# Altium schematic sheet Audio.SchDoc: Audio
size A4; DrawnBy: TueTD; Stage: DRAFT
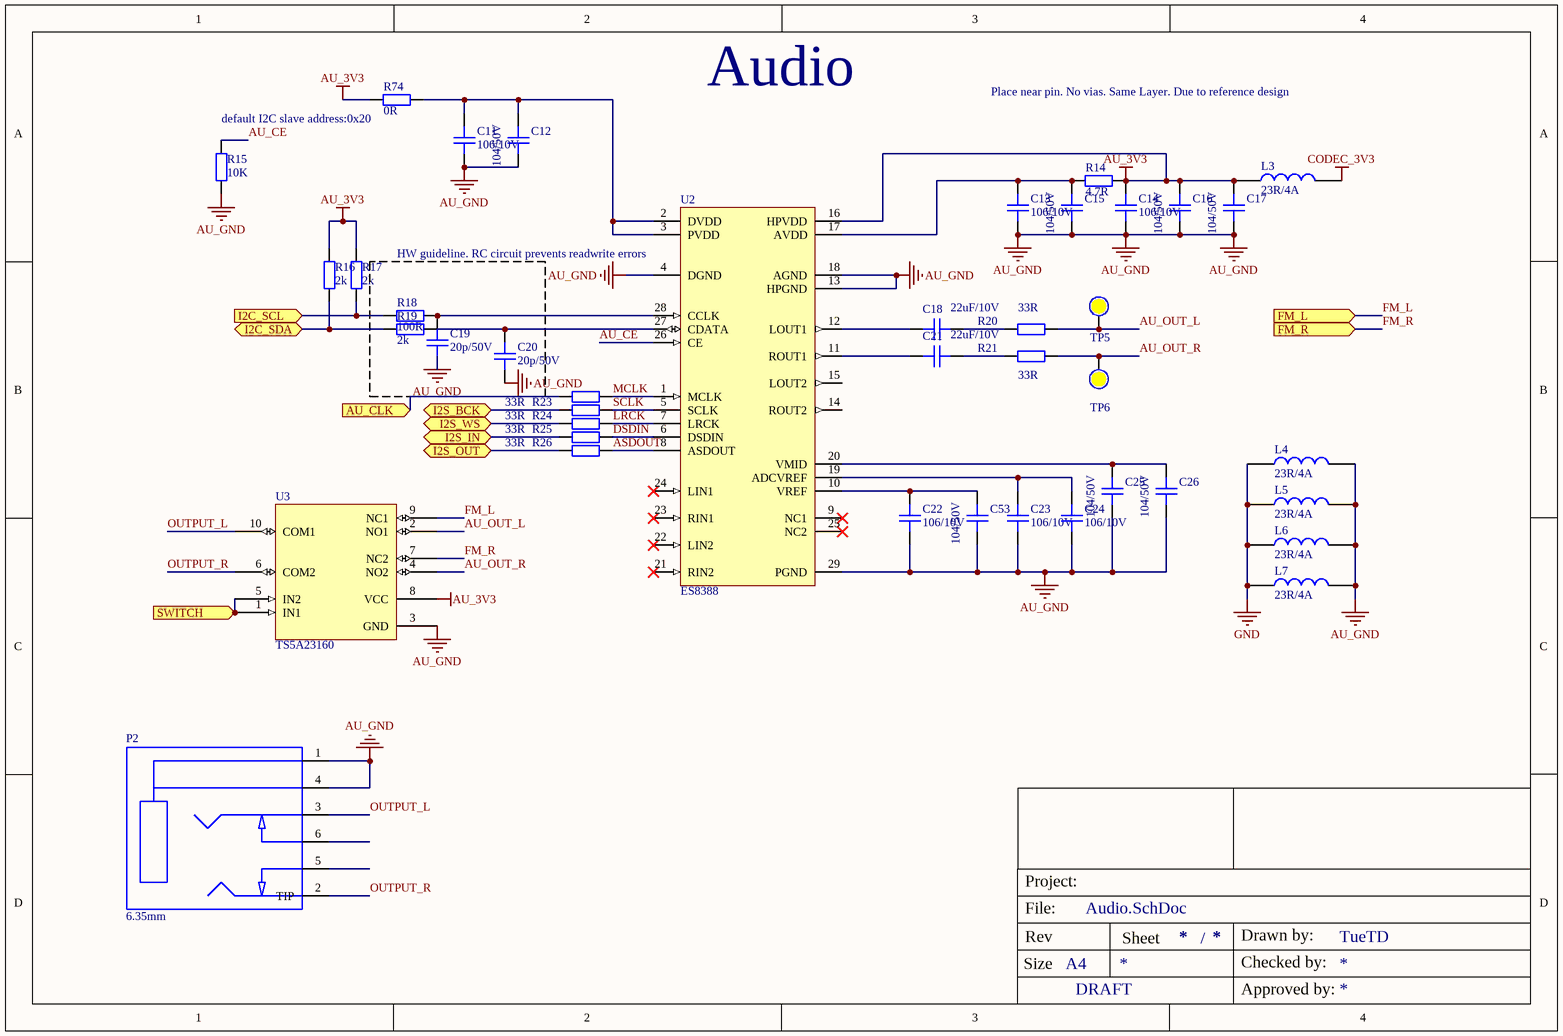
[diagram p0: Audio.SchDoc]

## Parts
C11  106/10V  [CAPC-0603 (1608)]
C12  104/50V  [CAPC-0603 (1608)]
C13  106/10V  [CAPC-0603 (1608)]
C14  106/10V  [CAPC-0603 (1608)]
C15  104/50V  [CAPC-0603 (1608)]
C16  104/50V  [CAPC-0603 (1608)]
C17  104/50V  [CAPC-0603 (1608)]
C18  22uF/10V  [CAPC-0603 (1608)]
C19  20p/50V  [CAPC-0603 (1608)]
C20  20p/50V  [CAPC-0603 (1608)]
C21  22uF/10V  [CAPC-0603 (1608)]
C22  106/10V  [CAPC-0603 (1608)]
C23  106/10V  [CAPC-0603 (1608)]
C24  106/10V  [CAPC-0603 (1608)]
C25  104/50V  [CAPC-0603 (1608)]
C26  104/50V  [CAPC-0603 (1608)]
C53  104/50V  [CAPC-0603 (1608)]
L3  23R/4A  [IND-0603 (1608)]
L4  23R/4A  [IND-0603 (1608)]
L5  23R/4A  [IND-0603 (1608)]
L6  23R/4A  [IND-0603 (1608)]
L7  23R/4A  [IND-0603 (1608)]
P2  6.35mm  [CK-6.35-636A]
R14  4.7R  [RESC-0603 (1608)]
R15  10K  [RESC-0603 (1608)]
R16  2k  [RESC-0603 (1608)]
R17  2k  [RESC-0603 (1608)]
R18  100R  [RESC-0603 (1608)]
R19  2k  [RESC-0603 (1608)]
R20  33R  [RESC-0603 (1608)]
R21  33R  [RESC-0603 (1608)]
R22  33R  [RESC-0603 (1608)]  (value not drawn)
R23  33R  [RESC-0603 (1608)]
R24  33R  [RESC-0603 (1608)]
R25  33R  [RESC-0603 (1608)]
R26  33R  [RESC-0603 (1608)]
R74  0R  [RESC-0603 (1608)]
TP5  (no value)  [Test Point 1.5 MM]  (no BOM)
TP6  (no value)  [Test Point 1.5 MM]  (no BOM)
U2  ES8388  [QFN28 - ES8388]
U3  TS5A23160  [TSSOP50P490X110-10N]

## Blocks framed on the sheet
HW guideline. RC circuit prevents readwrite errors: C19 C20 R18 R19

## Ports
AU_CLK (in), FM_L (in), FM_R (in), I2C_SCL (in), I2C_SDA (bidir), I2S_BCK (bidir), I2S_IN (bidir), I2S_OUT (bidir), I2S_WS (bidir), SWITCH (in)

## Nets
AU_3V3: C14.2 C16.2 C17.2 L3.1 R14.2 R16.2 R17.2 R74.1 U2.16(HPVDD) U3.8(VCC)
AU_GND: C11.1 C12.1 C13.1 C14.1 C15.1 C16.1 C17.1 C19.1 C20.1 C22.1 C23.1 C24.1 C25.1 C26.1 C53.1 L4.2 L5.2 L6.2 L7.2 P2.1(SLEEVE) P2.4(SLEEVE) R15.1 U2.4(DGND) U2.13(HPGND) U2.18(AGND) U2.29(PGND) U3.3(GND)
CODEC_3V3: L3.2
GND: L4.1 L5.1 L6.1 L7.1
ASDOUT: R26.2 U2.8(ASDOUT)
AU_CE: R15.2 U2.26(CE)
AU_CLK: R22.1 ; port AU_CLK
AU_OUT_L: R20.2 TP5.0 U3.2(NO1)
AU_OUT_R: R21.2 TP6.0 U3.4(NO2)
DSDIN: R25.2 U2.6(DSDIN)
FM_L: U3.9(NC1) ; port FM_L
FM_R: U3.7(NC2) ; port FM_R
I2C_SCL: R17.1 R18.1 ; port I2C_SCL
I2C_SDA: R16.1 R19.1 ; port I2C_SDA
I2S_BCK: R23.1 ; port I2S_BCK
I2S_IN: R25.1 ; port I2S_IN
I2S_OUT: R26.1 ; port I2S_OUT
I2S_WS: R24.1 ; port I2S_WS
LRCK: R24.2 U2.7(LRCK)
MCLK: R22.2 U2.1(MCLK)
OUTPUT_L: P2.3(RING) U3.10(COM1)
OUTPUT_R: P2.2(TIP) U3.6(COM2)
SCLK: R23.2 U2.5(SCLK)
SWITCH: U3.1(IN1) U3.5(IN2) ; port SWITCH
NetC11_2: C11.2 C12.2 R74.2 U2.2(DVDD) U2.3(PVDD)
NetC13_2: C13.2 C15.2 R14.1 U2.17(AVDD)
NetC18_1: C18.1 R20.1
NetC18_2: C18.2 U2.12(LOUT1)
NetC19_2: C19.2 R18.2 U2.28(CCLK)
NetC20_2: C20.2 R19.2 U2.27(CDATA)
NetC21_1: C21.1 R21.1
NetC21_2: C21.2 U2.11(ROUT1)
NetC22_2: C22.2 C53.2 U2.10(VREF)
NetC23_2: C23.2 C24.2 U2.19(ADCVREF)
NetC25_2: C25.2 C26.2 U2.20(VMID)

Not connected (* = marked no-connect by the designer): P2 5(TIP_SWITCH) 6(RING_SWITCH); U2 9(NC1)* 14(ROUT2) 15(LOUT2) 21(RIN2)* 22(LIN2)* 23(RIN1)* 24(LIN1)* 25(NC2)*

## Notes on the sheet
- Place near pin. No vias. Same Layer. Due to reference design
- (near R74) default I2C slave address:0x20
- Project:
- File:
- Size
- Rev
- A4
- Sheet
- /
- Drawn by:
- Checked by:
- Approved by:

## Library data of the parts
C11 C13 C14 C22-C24 = CL10A106KP8NNNC: CAP CER 10uF 10% 10V X5R 0603; CompanyID: VT-00984; Solder: SMT; MPN: CL10A106KP8NNNC; Value: 106/10V; Category: CAPACITOR
C12 C15-C17 C25 C26 C53 = C0603C104K5RACTU: CAP CER 0.1uF 50V 10% X7R 0603; CompanyID: VT-00982; Solder: SMT; MPN: C0603C104K5RACTU; Value: 104/50V; Category: CAPACITOR
C18 C21 = CL10A226MPCNUBE: CAP CER 22UF 10V X5R 0603; CompanyID: VT-00192; Solder: SMT; MPN: CL10A226MPCNUBE; Value: 22uF/10V; Category: CAPACITOR
C19 C20 = CL10C200JB8NNNC: CAP CER 20pF 5% 50V C0G/NP0 0603; CompanyID: VT-00515; Solder: SMT; Value: 20p/50V; MPN: CL10C200JB8NNNC; Category: CAPACITOR
L3-L7 = FBMJ1608HM230NT: IND-FERRITE BEAD 23 OHM  4A 0603 1LN; CompanyID: VT-01060; Solder: SMT; MPN: FBMJ1608HM230NT; Value: 23R/4A; Category: FERRITE BEAD
P2 = CK-6.35-636A: CONN JACK STEREO 1/4" R/A; MFR: DONGGUAN YIJIAN ELECTRONICS CO., LTD.; Solder: WAVE; MFR_URL: https://wzyjdzkj.taobao.com; MPN: CK-6.35-636A; Value: CK-6.35-636A; ClassName: MECHANICAL
R14 = RC0603FR-074R7L: RES SMD 4.7 OHM 1% 1/10W 0603; Solder: SMT; Value: 4.7R; MPN: RC0603FR-074R7L; Category: RESISTOR
R15 = RC0603FR-0710KL: RES SMD 10K OHM 1% 1/10W 0603; CompanyID: VT-00328; Solder: SMT; MPN: RC0603FR-0710KL; Value: 10K; Category: RESISTOR
R16 R17 R19 = RC0603FR-072KL: RES SMD 2 KOHM 1% 1/10W 0603; CompanyID: VT-00326; Solder: SMT; MPN: RC0603FR-072KL; Value: 2k; Category: RESISTOR
R18 = RC0603FR-07100RL: RES SMD 100 OHM 1% 1/10W 0603; CompanyID: VT-00499; Solder: SMT; MPN: RC0603FR-07100RL; Value: 100R; Category: RESISTOR
R20-R26 = RC0603FR-0733RL: RES SMD 33 OHM 1% 1/10W 0603; MFR: Yageo; Solder: SMT; MPN: RC0603FR-0733RL; Value: 33R; Category: RESISTOR
R74 = RC0603FR-070RL: RES SMD 0.0OHM JUMPER 1/10W 0603; CompanyID: VT-00901; Solder: SMT; MPN: RC0603FR-070RL; Value: 0R; Category: RESISTOR
TP5 TP6 = Test Point: Solder: NF
U2 = ES8388: The Audio Codec Chip, is a low power stereo audio codec; MFR: Everest-Semi; Solder: SMT; MPN: ES8388; Value: ES8388; Category: IC; PinCount: 29
U3 = TS5A23160DGSR: IC SWITCH SPDT DUAL 10VSSOP; MFR: Texas Instruments; Solder: SMT; MPN: TS5A23160DGSR; Value: TS5A23160; Category: IC